# Altium schematic sheet Grabber_DIOT.schdoc: Grabber_DIOT
size 420 x 297 mm; Author: G.K.; CompanyName: WUT; DrawnBy: G.K.; Organization: WUT; Address1: Warsaw Univeristy of Technology; Address2: Nowowiejska 15/19; DocumentNumber: 1; SheetNumber: 2; SheetTotal: 5; EDA_Number: ARTIQ; Projet: ARTIQ/Sinara; ModifiedBy: -; CreateDate: -; CheckedDate: -; Title2: Extension board; DivGrp: ISE; Designer: G.K.; ModifiedDate: -; ProjectName: KASLI 3U subsystem
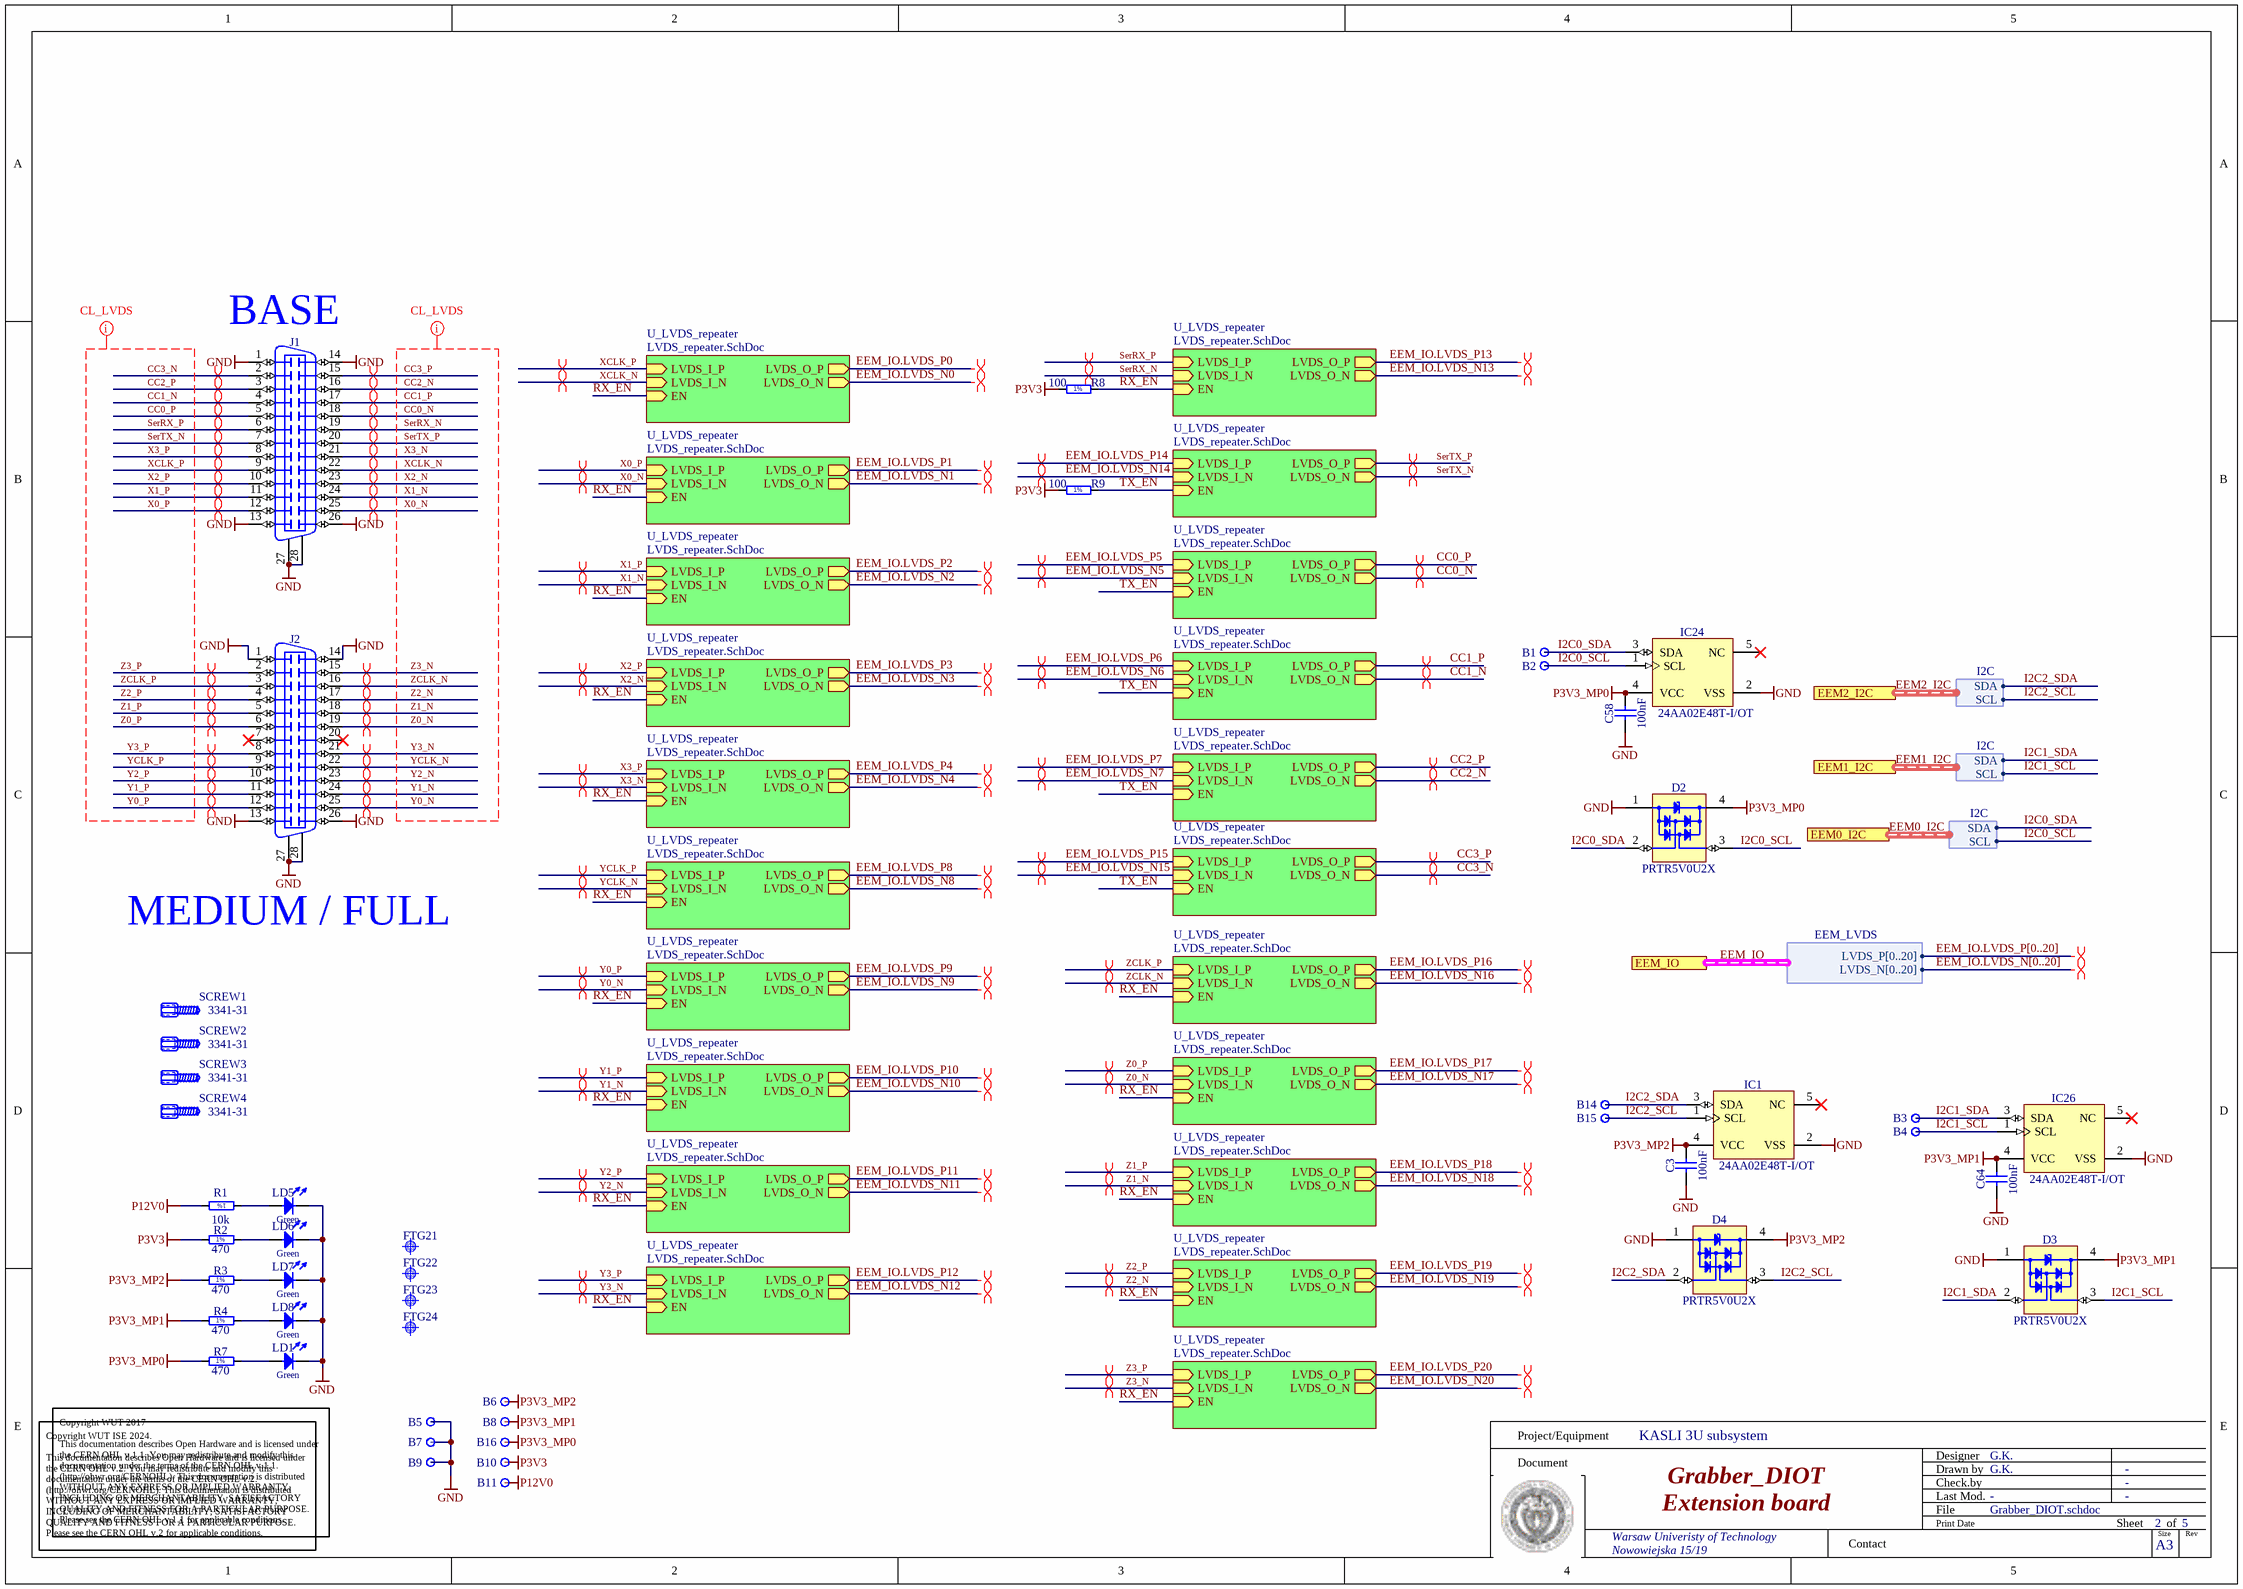
[diagram p0: Grabber_DIOT.schdoc]

## Parts
B1  Plated Hole  [c100h50]  (value not drawn)
B2  Plated Hole  [c100h50]  (value not drawn)
B3  Plated Hole  [c100h50]  (value not drawn)
B4  Plated Hole  [c100h50]  (value not drawn)
B5  Plated Hole  [c100h50]  (value not drawn)
B6  Plated Hole  [c100h50]  (value not drawn)
B7  Plated Hole  [c100h50]  (value not drawn)
B8  Plated Hole  [c100h50]  (value not drawn)
B9  Plated Hole  [c100h50]  (value not drawn)
B10  Plated Hole  [c100h50]  (value not drawn)
B11  Plated Hole  [c100h50]  (value not drawn)
B14  Plated Hole  [c100h50]  (value not drawn)
B15  Plated Hole  [c100h50]  (value not drawn)
B16  Plated Hole  [c100h50]  (value not drawn)
C3  100nF  [CAPC1005X55N]
C58  100nF  [CAPC1005X55N]
C64  100nF  [CAPC1005X55N]
D2  PRTR5V0U2X  [SOT190P230X110-4N]
D3  PRTR5V0U2X  [SOT190P230X110-4N]
D4  PRTR5V0U2X  [SOT190P230X110-4N]
FTG21  Use only in PCB  [FIDUCIAL_TOP_C100-200]  (value not drawn)
FTG22  Use only in PCB  [FIDUCIAL_TOP_S100-200]  (value not drawn)
FTG23  Use only in PCB  [FIDUCIAL_TOP_S200-400]  (value not drawn)
FTG24  Use only in PCB  [FIDUCIAL_TOP_S100-200]  (value not drawn)
IC1  24AA02E48T-I/OT  [SOT95P280X145-5N]
IC24  24AA02E48T-I/OT  [SOT95P280X145-5N]
IC26  24AA02E48T-I/OT  [SOT95P280X145-5N]
J1  N10226-5212PC  [3M_N10226-5212PC]  (value not drawn)
J2  N10226-5212PC  [3M_N10226-5212PC]  (value not drawn)
LD1  Green  [LED_KINGBRIGHT_KP-1608CGCK]  (value not drawn)
LD5  Green  [LED_KINGBRIGHT_KP-1608CGCK]  (value not drawn)
LD6  Green  [LED_KINGBRIGHT_KP-1608CGCK]  (value not drawn)
LD7  Green  [LED_KINGBRIGHT_KP-1608CGCK]  (value not drawn)
LD8  Green  [LED_KINGBRIGHT_KP-1608CGCK]  (value not drawn)
R1  10k  [RESC1005X40N]
R2  470  [RESC1005X40N]
R3  470  [RESC1005X40N]
R4  470  [RESC1005X40N]
R7  470  [RESC1005X40N]
R8  100  [RESC1005X40N]
R9  100  [RESC1005X40N]
SCREW1  3341-31  [3M_3341-31]
SCREW2  3341-31  [3M_3341-31]
SCREW3  3341-31  [3M_3341-31]
SCREW4  3341-31  [3M_3341-31]

## Sub-sheets
U_LVDS_repeater = LVDS_repeater.SchDoc: LVDS_I_P (in), LVDS_I_N (in), LVDS_O_P (out), LVDS_O_N (out), EN (in)
U_LVDS_repeater = LVDS_repeater.SchDoc: LVDS_I_P (in), LVDS_I_N (in), LVDS_O_P (out), LVDS_O_N (out), EN (in)
U_LVDS_repeater = LVDS_repeater.SchDoc: LVDS_I_P (in), LVDS_I_N (in), LVDS_O_P (out), LVDS_O_N (out), EN (in)
U_LVDS_repeater = LVDS_repeater.SchDoc: LVDS_I_P (in), LVDS_I_N (in), LVDS_O_P (out), LVDS_O_N (out), EN (in)
U_LVDS_repeater = LVDS_repeater.SchDoc: LVDS_I_P (in), LVDS_I_N (in), LVDS_O_P (out), LVDS_O_N (out), EN (in)
U_LVDS_repeater = LVDS_repeater.SchDoc: LVDS_I_P (in), LVDS_I_N (in), LVDS_O_P (out), LVDS_O_N (out), EN (in)
U_LVDS_repeater = LVDS_repeater.SchDoc: LVDS_I_P (in), LVDS_I_N (in), LVDS_O_P (out), LVDS_O_N (out), EN (in)
U_LVDS_repeater = LVDS_repeater.SchDoc: LVDS_I_P (in), LVDS_I_N (in), LVDS_O_P (out), LVDS_O_N (out), EN (in)
U_LVDS_repeater = LVDS_repeater.SchDoc: LVDS_I_P (in), LVDS_I_N (in), LVDS_O_P (out), LVDS_O_N (out), EN (in)
U_LVDS_repeater = LVDS_repeater.SchDoc: LVDS_I_P (in), LVDS_I_N (in), LVDS_O_P (out), LVDS_O_N (out), EN (in)
U_LVDS_repeater = LVDS_repeater.SchDoc: LVDS_I_P (in), LVDS_I_N (in), LVDS_O_P (out), LVDS_O_N (out), EN (in)
U_LVDS_repeater = LVDS_repeater.SchDoc: LVDS_I_P (in), LVDS_I_N (in), LVDS_O_P (out), LVDS_O_N (out), EN (in)
U_LVDS_repeater = LVDS_repeater.SchDoc: LVDS_I_P (in), LVDS_I_N (in), LVDS_O_P (out), LVDS_O_N (out), EN (in)
U_LVDS_repeater = LVDS_repeater.SchDoc: LVDS_I_P (in), LVDS_I_N (in), LVDS_O_P (out), LVDS_O_N (out), EN (in)
U_LVDS_repeater = LVDS_repeater.SchDoc: LVDS_I_P (in), LVDS_I_N (in), LVDS_O_P (out), LVDS_O_N (out), EN (in)
U_LVDS_repeater = LVDS_repeater.SchDoc: LVDS_I_P (in), LVDS_I_N (in), LVDS_O_P (out), LVDS_O_N (out), EN (in)
U_LVDS_repeater = LVDS_repeater.SchDoc: LVDS_I_P (in), LVDS_I_N (in), LVDS_O_P (out), LVDS_O_N (out), EN (in)
U_LVDS_repeater = LVDS_repeater.SchDoc: LVDS_I_P (in), LVDS_I_N (in), LVDS_O_P (out), LVDS_O_N (out), EN (in)
U_LVDS_repeater = LVDS_repeater.SchDoc: LVDS_I_P (in), LVDS_I_N (in), LVDS_O_P (out), LVDS_O_N (out), EN (in)
U_LVDS_repeater = LVDS_repeater.SchDoc: LVDS_I_P (in), LVDS_I_N (in), LVDS_O_P (out), LVDS_O_N (out), EN (in)
U_LVDS_repeater = LVDS_repeater.SchDoc: LVDS_I_P (in), LVDS_I_N (in), LVDS_O_P (out), LVDS_O_N (out), EN (in)

## Ports
EEM0_I2C (harness I2C), EEM1_I2C (harness I2C), EEM2_I2C (harness I2C), EEM_IO (harness EEM_LVDS)

## Harnesses
EEM_LVDS: LVDS_P[0..20], LVDS_N[0..20]
I2C: SDA, SCL

## Nets
GND: B5.1 B7.1 B9.1 C3.1 C58.1 C64.1 D2.1(GND) D3.1(GND) D4.1(GND) IC1.2(VSS) IC24.2(VSS) IC26.2(VSS) J1.1 J1.13 J1.14 J1.26 J1.27 J1.28 J2.1 J2.13 J2.14 J2.26 J2.27 J2.28 LD1.1(C) LD5.1(C) LD6.1(C) LD7.1(C) LD8.1(C)
P3V3: B10.1 R2.1 R8.1 R9.1
P3V3_MP0: B16.1 C58.2 D2.4(VCC) IC24.4(VCC) R7.1
P3V3_MP1: B8.1 C64.2 D3.4(VCC) IC26.4(VCC) R4.1
P3V3_MP2: B6.1 C3.2 D4.4(VCC) IC1.4(VCC) R3.1
P12V0: B11.1 R1.2
CC0_N: J1.18 ; sheet U_LVDS_repeater/LVDS_O_N
CC0_P: J1.5 ; sheet U_LVDS_repeater/LVDS_O_P
CC1_N: J1.4 ; sheet U_LVDS_repeater/LVDS_O_N
CC1_P: J1.17 ; sheet U_LVDS_repeater/LVDS_O_P
CC2_N: J1.16 ; sheet U_LVDS_repeater/LVDS_O_N
CC2_P: J1.3 ; sheet U_LVDS_repeater/LVDS_O_P
CC3_N: J1.2 ; sheet U_LVDS_repeater/LVDS_O_N
CC3_P: J1.15 ; sheet U_LVDS_repeater/LVDS_O_P
EEM_IO.LVDS_N0: sheet U_LVDS_repeater/LVDS_O_N
EEM_IO.LVDS_N1: sheet U_LVDS_repeater/LVDS_O_N
EEM_IO.LVDS_N2: sheet U_LVDS_repeater/LVDS_O_N
EEM_IO.LVDS_N3: sheet U_LVDS_repeater/LVDS_O_N
EEM_IO.LVDS_N4: sheet U_LVDS_repeater/LVDS_O_N
EEM_IO.LVDS_N5: sheet U_LVDS_repeater/LVDS_I_N
EEM_IO.LVDS_N6: sheet U_LVDS_repeater/LVDS_I_N
EEM_IO.LVDS_N7: sheet U_LVDS_repeater/LVDS_I_N
EEM_IO.LVDS_N8: sheet U_LVDS_repeater/LVDS_O_N
EEM_IO.LVDS_N9: sheet U_LVDS_repeater/LVDS_O_N
EEM_IO.LVDS_N10: sheet U_LVDS_repeater/LVDS_O_N
EEM_IO.LVDS_N11: sheet U_LVDS_repeater/LVDS_O_N
EEM_IO.LVDS_N12: sheet U_LVDS_repeater/LVDS_O_N
EEM_IO.LVDS_N13: sheet U_LVDS_repeater/LVDS_O_N
EEM_IO.LVDS_N14: sheet U_LVDS_repeater/LVDS_I_N
EEM_IO.LVDS_N15: sheet U_LVDS_repeater/LVDS_I_N
EEM_IO.LVDS_N16: sheet U_LVDS_repeater/LVDS_O_N
EEM_IO.LVDS_N17: sheet U_LVDS_repeater/LVDS_O_N
EEM_IO.LVDS_N18: sheet U_LVDS_repeater/LVDS_O_N
EEM_IO.LVDS_N19: sheet U_LVDS_repeater/LVDS_O_N
EEM_IO.LVDS_N20: sheet U_LVDS_repeater/LVDS_O_N
EEM_IO.LVDS_P0: sheet U_LVDS_repeater/LVDS_O_P
EEM_IO.LVDS_P1: sheet U_LVDS_repeater/LVDS_O_P
EEM_IO.LVDS_P2: sheet U_LVDS_repeater/LVDS_O_P
EEM_IO.LVDS_P3: sheet U_LVDS_repeater/LVDS_O_P
EEM_IO.LVDS_P4: sheet U_LVDS_repeater/LVDS_O_P
EEM_IO.LVDS_P5: sheet U_LVDS_repeater/LVDS_I_P
EEM_IO.LVDS_P6: sheet U_LVDS_repeater/LVDS_I_P
EEM_IO.LVDS_P7: sheet U_LVDS_repeater/LVDS_I_P
EEM_IO.LVDS_P8: sheet U_LVDS_repeater/LVDS_O_P
EEM_IO.LVDS_P9: sheet U_LVDS_repeater/LVDS_O_P
EEM_IO.LVDS_P10: sheet U_LVDS_repeater/LVDS_O_P
EEM_IO.LVDS_P11: sheet U_LVDS_repeater/LVDS_O_P
EEM_IO.LVDS_P12: sheet U_LVDS_repeater/LVDS_O_P
EEM_IO.LVDS_P13: sheet U_LVDS_repeater/LVDS_O_P
EEM_IO.LVDS_P14: sheet U_LVDS_repeater/LVDS_I_P
EEM_IO.LVDS_P15: sheet U_LVDS_repeater/LVDS_I_P
EEM_IO.LVDS_P16: sheet U_LVDS_repeater/LVDS_O_P
EEM_IO.LVDS_P17: sheet U_LVDS_repeater/LVDS_O_P
EEM_IO.LVDS_P18: sheet U_LVDS_repeater/LVDS_O_P
EEM_IO.LVDS_P19: sheet U_LVDS_repeater/LVDS_O_P
EEM_IO.LVDS_P20: sheet U_LVDS_repeater/LVDS_O_P
I2C0_SCL: B2.1 D2.3(I/O2) IC24.1(SCL) ; port EEM0_I2C.SCL  [project net EEM0_I2C.SCL]
I2C0_SDA: B1.1 D2.2(I/O1) IC24.3(SDA) ; port EEM0_I2C.SDA  [project net EEM0_I2C.SDA]
I2C1_SCL: B4.1 D3.3(I/O2) IC26.1(SCL) ; port EEM1_I2C.SCL  [project net EEM1_I2C.SCL]
I2C1_SDA: B3.1 D3.2(I/O1) IC26.3(SDA) ; port EEM1_I2C.SDA  [project net EEM1_I2C.SDA]
I2C2_SCL: B15.1 D4.3(I/O2) IC1.1(SCL) ; port EEM2_I2C.SCL  [project net EEM2_I2C.SCL]
I2C2_SDA: B14.1 D4.2(I/O1) IC1.3(SDA) ; port EEM2_I2C.SDA  [project net EEM2_I2C.SDA]
RX_EN: R8.2 ; sheet U_LVDS_repeater/EN, sheet U_LVDS_repeater/EN, sheet U_LVDS_repeater/EN, sheet U_LVDS_repeater/EN, sheet U_LVDS_repeater/EN, sheet U_LVDS_repeater/EN, sheet U_LVDS_repeater/EN, sheet U_LVDS_repeater/EN, sheet U_LVDS_repeater/EN, sheet U_LVDS_repeater/EN, sheet U_LVDS_repeater/EN, sheet U_LVDS_repeater/EN, sheet U_LVDS_repeater/EN, sheet U_LVDS_repeater/EN, sheet U_LVDS_repeater/EN, sheet U_LVDS_repeater/EN
SerRX_N: J1.19 ; sheet U_LVDS_repeater/LVDS_I_N
SerRX_P: J1.6 ; sheet U_LVDS_repeater/LVDS_I_P
SerTX_N: J1.7 ; sheet U_LVDS_repeater/LVDS_O_N
SerTX_P: J1.20 ; sheet U_LVDS_repeater/LVDS_O_P
TX_EN: R9.2 ; sheet U_LVDS_repeater/EN, sheet U_LVDS_repeater/EN, sheet U_LVDS_repeater/EN, sheet U_LVDS_repeater/EN, sheet U_LVDS_repeater/EN
X0_N: J1.25 ; sheet U_LVDS_repeater/LVDS_I_N
X0_P: J1.12 ; sheet U_LVDS_repeater/LVDS_I_P
X1_N: J1.24 ; sheet U_LVDS_repeater/LVDS_I_N
X1_P: J1.11 ; sheet U_LVDS_repeater/LVDS_I_P
X2_N: J1.23 ; sheet U_LVDS_repeater/LVDS_I_N
X2_P: J1.10 ; sheet U_LVDS_repeater/LVDS_I_P
X3_N: J1.21 ; sheet U_LVDS_repeater/LVDS_I_N
X3_P: J1.8 ; sheet U_LVDS_repeater/LVDS_I_P
XCLK_N: J1.22 ; sheet U_LVDS_repeater/LVDS_I_N
XCLK_P: J1.9 ; sheet U_LVDS_repeater/LVDS_I_P
Y0_N: J2.25 ; sheet U_LVDS_repeater/LVDS_I_N
Y0_P: J2.12 ; sheet U_LVDS_repeater/LVDS_I_P
Y1_N: J2.24 ; sheet U_LVDS_repeater/LVDS_I_N
Y1_P: J2.11 ; sheet U_LVDS_repeater/LVDS_I_P
Y2_N: J2.23 ; sheet U_LVDS_repeater/LVDS_I_N
Y2_P: J2.10 ; sheet U_LVDS_repeater/LVDS_I_P
Y3_N: J2.21 ; sheet U_LVDS_repeater/LVDS_I_N
Y3_P: J2.8 ; sheet U_LVDS_repeater/LVDS_I_P
YCLK_N: J2.22 ; sheet U_LVDS_repeater/LVDS_I_N
YCLK_P: J2.9 ; sheet U_LVDS_repeater/LVDS_I_P
Z0_N: J2.19 ; sheet U_LVDS_repeater/LVDS_I_N
Z0_P: J2.6 ; sheet U_LVDS_repeater/LVDS_I_P
Z1_N: J2.18 ; sheet U_LVDS_repeater/LVDS_I_N
Z1_P: J2.5 ; sheet U_LVDS_repeater/LVDS_I_P
Z2_N: J2.17 ; sheet U_LVDS_repeater/LVDS_I_N
Z2_P: J2.4 ; sheet U_LVDS_repeater/LVDS_I_P
Z3_N: J2.15 ; sheet U_LVDS_repeater/LVDS_I_N
Z3_P: J2.2 ; sheet U_LVDS_repeater/LVDS_I_P
ZCLK_N: J2.16 ; sheet U_LVDS_repeater/LVDS_I_N
ZCLK_P: J2.3 ; sheet U_LVDS_repeater/LVDS_I_P
NetLD1_2: LD1.2(A) R7.2
NetLD5_2: LD5.2(A) R1.1
NetLD6_2: LD6.2(A) R2.2
NetLD7_2: LD7.2(A) R3.2
NetLD8_2: LD8.2(A) R4.2

Not connected (* = marked no-connect by the designer): IC1 5(NC)*; IC24 5(NC)*; IC26 5(NC)*; J2 7* 20*

## Buses and harness runs
bus EEM_IO.LVDS_N[0..20]
bus EEM_IO.LVDS_P[0..20]
harness EEM0_I2C = port EEM0_I2C
harness EEM1_I2C = port EEM1_I2C
harness EEM2_I2C = port EEM2_I2C
harness EEM_IO = port EEM_IO

## Layout directives
differential pair: CC0_N, CC0_P, CC1_N, CC1_P, CC2_N, CC2_P, CC3_N, CC3_P, EEM_IO.LVDS_N0, EEM_IO.LVDS_N1, EEM_IO.LVDS_N2, EEM_IO.LVDS_N3, EEM_IO.LVDS_N4, EEM_IO.LVDS_N5, EEM_IO.LVDS_N6, EEM_IO.LVDS_N7, EEM_IO.LVDS_N8, EEM_IO.LVDS_N9, EEM_IO.LVDS_N10, EEM_IO.LVDS_N11, EEM_IO.LVDS_N12, EEM_IO.LVDS_N13, EEM_IO.LVDS_N14, EEM_IO.LVDS_N15, EEM_IO.LVDS_N16, EEM_IO.LVDS_N17, EEM_IO.LVDS_N18, EEM_IO.LVDS_N19, EEM_IO.LVDS_N20, EEM_IO.LVDS_P0, EEM_IO.LVDS_P1, EEM_IO.LVDS_P2, EEM_IO.LVDS_P3, EEM_IO.LVDS_P4, EEM_IO.LVDS_P5, EEM_IO.LVDS_P6, EEM_IO.LVDS_P7, EEM_IO.LVDS_P8, EEM_IO.LVDS_P9, EEM_IO.LVDS_P10, EEM_IO.LVDS_P11, EEM_IO.LVDS_P12, EEM_IO.LVDS_P13, EEM_IO.LVDS_P14, EEM_IO.LVDS_P15, EEM_IO.LVDS_P16, EEM_IO.LVDS_P17, EEM_IO.LVDS_P18, EEM_IO.LVDS_P19, EEM_IO.LVDS_P20, SerRX_N, SerRX_P, SerTX_N, SerTX_P, X0_N, X0_P, X1_N, X1_P, X2_N, X2_P, X3_N, X3_P, XCLK_N, XCLK_P, Y0_N, Y0_P, Y1_N, Y1_P, Y2_N, Y2_P, Y3_N, Y3_P, YCLK_N, YCLK_P, Z0_N, Z0_P, Z1_N, Z1_P, Z2_N, Z2_P, Z3_N, Z3_P, ZCLK_N, ZCLK_P
net class CL_LVDS: CC0_N, CC0_P, CC1_N, CC1_P, CC2_N, CC2_P, CC3_N, CC3_P, SerRX_N, SerRX_P, SerTX_N, SerTX_P, X0_N, X0_P, X1_N, X1_P, X2_N, X2_P, X3_N, X3_P, XCLK_N, XCLK_P, Y0_N, Y0_P, Y1_N, Y1_P, Y2_N, Y2_P, Y3_N, Y3_P, YCLK_N, YCLK_P, Z0_N, Z0_P, Z1_N, Z1_P, Z2_N, Z2_P, Z3_N, Z3_P, ZCLK_N, ZCLK_P
differential pair; differential pair class Diff_100Ohm: (no net found under the mark)

## Notes on the sheet
- (near J1) BASE
- MEDIUM / FULL
- Copyright WUT 2017
  This documentation describes Open Hardware and is licensed under the CERN OHL v.1.1. You may redistribute and modify this documentation under the terms of the CERN OHL v.1.1. (http://ohwr.org/CERNOHL). This documentation is distributed WITHOUT ANY EXPRESS OR IMPLIED WARRANTY, INCLUDING OF MERCHANTABILITY, SATISFACTORY QUALITY AND FITNESS FOR A PARTICULAR PURPOSE. Please see the CERN OHL v.1.1 for applicable conditions.
- Project/Equipment
- Document
- Designer
- Drawn by
- Check.by
- Copyright WUT ISE 2024.
  This documentation describes Open Hardware and is licensed under the CERN OHL v.2. You may redistribute and modify this documentation under the terms of the CERN OHL v.2. (http://ohwr.org/CERNOHL). This documentation is distributed WITHOUT ANY EXPRESS OR IMPLIED WARRANTY, INCLUDING OF MERCHANTABILITY, SATISFACTORY QUALITY AND FITNESS FOR A PARTICULAR PURPOSE. Please see the CERN OHL v.2 for applicable conditions.
- Contact
- File
- Last Mod.
- Print Date
- Sheet
- Size
- A3
- of
- Rev
- (in symbol R0402_10K_1%_0.0625W_100PPM) 1%
- (in symbol R0402_100R_1%_0.1W_100PPM) 1%
- (in symbol R0402_470R_1%_0.0625W_100PPM) 1%

## Library data of the parts
B1-B11 B14-B16 = PLATED_HOLE0.6_PAD1.3: Single Terminal Socket; Part Description: Plated Through Hole: Hole Dia.=0.6mm Pad Dia.=1.3mm; Mounted: No; Part Number: PLATED_HOLE0.6_PAD1.3; Component Kind: Standard (No BOM); Component Type: Standard (No BOM); Footprint: c130h60; Pin Count: 1; Family: Plated Hole; Socket: No; SMD: No; Sense: No; Status: None; ComponentHeight: 0mm; HelpURL: Undefined; Author: CERN DEM MR; CreateDate: 02.03.2016; LatestRevisionDate: 02.03.2016; PackageDescription: Plated Through Hole: Hole Dia.=0.6mm Pad Dia.=1.3mm
C3 C58 C64 = CC0402_100NF_16V_10%_X5R: Non-polarised capacitor; Part Description: SMD Multilayer Chip Ceramic Capacitor; Manufacturer: GENERIC; Manufacturer1 Part Number: GRM155R61C104KA88D; Voltage: 16V; TC: X5R; Tolerance: ±10%; Part Number: CC0402_100NF_16V_10%_X5R; Component Kind: Standard; Component Type: Standard; Pin Count: 2; Value: 100nF; Status: None; Manufacturer Part Number: CC0402_100NF_16V_10%_X5R; Case: 0402; Mounted: Yes; Socket: No; SMD: Yes; Sense: No; Manufacturer1 Example: MURATA; Manufacturer1 ComponentHeight: 0.55mm; HelpURL: \\cern.ch\dfs\Applications\Altium\Datasheets\CC0402_X5R_MURATA_GRM.pdf; Author: CERN DEM JLC; CreateDate: 10.12.2013; LatestRevisionDate: 10.12.2013
D2-D4 = PRTR5V0U2X: Ultra Low Capacitance Double Rail-to-Rail ESD Protection Diode; Part Description: Ultra Low Capacitance (1pF) Double Rail-to-Rail ESD Protection Diode (8kV); Manufacturer: NXP SEMICONDUCTORS; Voltage: 5.5V; PressFit: No; Bonding: No; Part Number: PRTR5V0U2X; Component Kind: Standard; Component Type: Standard; Device: PRTR5V0U2X; PackageDescription: SOT143B, SOT, 1.90mm Pitch; 4 Pin, 1.30mm W X 2.90mm L X 1.10mm H body, IPC Medium Density; Manufacturer Part Number: PRTR5V0U2X; Pin Count: 4; Case: SOT143B; Mounted: Yes; Socket: No; SMD: Yes; Sense: No; ComponentHeight: 1.1mm; HelpURL: \\cern.ch\dfs\Applications\Altium\Datasheets\PRTR5V0U2X.pdf; Author: CERN DEM JLC; CreateDate: 22.03.2011; LatestRevisionDate: 22.03.2011
FTG21 = FIDUCIAL_TARGET_C100-200: Fiducial Target; Part Description: Round Fiducial Target, Top Layer, 1.0mm, Top Solder 2.0mm, Keepout =2.0mm; Mounted: No; Part Number: FIDUCIAL_TARGET_C100-200; Component Kind: Standard (No BOM); Component Type: Standard (No BOM); Pin Count: 1; Family: Fiducial; Socket: No; SMD: Yes; Sense: No; Status: None; ComponentHeight: 0mm; HelpURL: Undefined; Author: CERN DEM JLC; CreateDate: 09.02.2010; LatestRevisionDate: 04.04.2012; PackageDescription: Round Fiducial Target, Top Layer, 1.0mm, Top Solder 2.0mm, Keepout =2.0mm
FTG22 FTG24 = FIDUCIAL_TARGET_S100-200: Fiducial Target; Part Description: Square Fiducial Target, Top Layer, 1.0mm, Top Solder 2.0mm, Keepout =2.0mm; Mounted: No; Part Number: FIDUCIAL_TARGET_S100-200; Component Kind: Standard (No BOM); Component Type: Standard (No BOM); Pin Count: 1; Family: Fiducial; Socket: No; SMD: Yes; Sense: No; Status: None; ComponentHeight: 0mm; HelpURL: Undefined; Author: CERN DEM JLC; CreateDate: 09.02.2010; LatestRevisionDate: 04.04.2012; PackageDescription: Square Fiducial Target, Top Layer, 1.0mm, Top Solder 2.0mm, Keepout =2.0mm
FTG23 = FIDUCIAL_TARGET_S200-400: Fiducial Target; Part Description: Square Fiducial Target, Top Layer, 2.0mm, Top Solder 4.0mm, Keepout =4.0mm; Mounted: No; Part Number: FIDUCIAL_TARGET_S200-400; Component Kind: Standard (No BOM); Component Type: Standard (No BOM); Pin Count: 1; Family: Fiducial; Socket: No; SMD: Yes; Sense: No; Status: None; ComponentHeight: 0mm; HelpURL: Undefined; Author: CERN DEM JLC; CreateDate: 02.06.2008; LatestRevisionDate: 04.04.2012; PackageDescription: Square Fiducial Target, Top Layer, 2.0mm, Top Solder 4.0mm, Keepout =4.0mm
IC1 IC24 IC26 = 24AA02E48T-I/OT: 1.7V-5.5V, 2K I2C Serial EEPROM With EUI-48 Node Identity; Manufacturer: MICROCHIP TECHNOLOGY; PressFit: No; Bonding: No; Part Number: 24AA02E48T-I/OT; Component Kind: Standard; Component Type: Standard; Device: 24AA02E48T-I/OT; PackageDescription: SOT, 0.95mm pitch; 5 pin, 1.60mm W X 2.90mm L X 1.45mm H body, IPC Medium Density; Part Description: 1.7V-5.5V, 2K I2C Serial EEPROM With EUI-48 Node Identity; Manufacturer Part Number: 24AA02E48T-I/OT; Pin Count: 5; Case: SOT23-5; Mounted: Yes; Socket: No; SMD: Yes; Sense: No; ComponentHeight: 1.45mm; HelpURL: \\cern.ch\dfs\Applications\Altium\Datasheets\24AA02E48T-I-OT.pdf; Author: CERN DEM MR; CreateDate: 31.03.2016; LatestRevisionDate: 31.03.2016
J1 J2 = 3M_N10226-5212PC: Connector Mini D Ribbon (MDR) 26 Female; Part Description: 26 contacts, Mini D Ribbon (MDR), .050" Boardmount Through-hole Right Angle Receptacle-Shielded, Diecast Body, 102 Series; Manufacturer: 3M; PressFit: No; Part Number: N10226-5212PC; Component Kind: Standard; Component Type: Standard; Footprint: MDR 26; Pin Count: 28; Family: MDR 26; Mounted: Yes; Socket: No; SMD: No; Sense: No; Status: None; Manufacturer Part Number: N10226-5212PC; ComponentHeight: 9.4mm; HelpURL: \\cern.ch\dfs\Applications\Altium\Datasheets\3M_N10226-5212PC.pdf; Author: CERN DEM JLC; CreateDate: 18.11.2008; LatestRevisionDate: 14.10.2009
LD1 LD5-LD8 = LED_KINGBRIGHT_KPH-1608CGCK: LED Green 1C 2A; Part Description: SMD Green LED, Case 1.6mmX0.8mm(0603), 0.65mm Thickness; PressFit: No; Bonding: No; Part Number: KPH-1608CGCK; Component Kind: Standard; Component Type: Standard; Color: Green; Footprint: LED_KINGBRIGHT_KPH-1608CGCK; PackageDescription: SMT Green LED, Case 0603, Body L 1.6 x W 0.8mm H 0.65mm; Manufacturer: KINGBRIGHT; Manufacturer Part Number: KPH-1608CGCK; Pin Count: 2; Mounted: Yes; Socket: No; SMD: Yes; Sense: No; ComponentHeight: 0.65mm; HelpURL: \\cern.ch\dfs\Applications\Altium\Datasheets\LED_KINGBRIGHT_KPH-1608CGCK.pdf; Author: CERN DEM JLC; CreateDate: 03.07.2017; LatestRevisionDate: 03.07.2017
R1 = R0402_10K_1%_0.0625W_100PPM: Resistor - 1%; Part Description: General Purpose Thick Film Chip Resistor; Manufacturer: GENERIC; Manufacturer1 Part Number: 232270671003L; TC: ±100ppm/°C; Part Number: R0402_10K_1%_0.0625W_100PPM; Component Kind: Standard; Component Type: Standard; Pin Count: 2; Value: 10k; Status: Not recommended; Power: 0.0625W; Tolerance: ±1%; Manufacturer Part Number: R0402_10K_1%_0.0625W_100PPM; Case: 0402; Mounted: Yes; Sense: No; Socket: No; SMD: Yes; Manufacturer1 Example: YAGEO PHYCOMP; Manufacturer1 ComponentHeight: 0.4mm; HelpURL: \\cern.ch\dfs\Applications\Altium\Datasheets\R0402_Phycomp_RC0402.pdf; Author: CERN DEM JLC; CreateDate: 03.12.2007; LatestRevisionDate: 17.10.2012
R2-R4 R7 = R0402_470R_1%_0.0625W_100PPM: Resistor - 1%; Part Description: General Purpose Thick Film Chip Resistor; Manufacturer: GENERIC; Manufacturer1 Part Number: 232270674701L; TC: ±100ppm/°C; PressFit: No; Part Number: R0402_470R_1%_0.0625W_100PPM; Component Kind: Standard; Component Type: Standard; Pin Count: 2; Value: 470; Status: Not Recommended; Power: 0.0625W; Tolerance: ±1%; Manufacturer Part Number: R0402_470R_1%_0.0625W_100PPM; Case: 0402; Mounted: Yes; Sense: No; Socket: No; SMD: Yes; Manufacturer1 Example: YAGEO PHYCOMP; Manufacturer1 ComponentHeight: 0.4mm; HelpURL: \\cern.ch\dfs\Applications\Altium\Datasheets\R0402_Phycomp_RC0402.pdf; Author: CERN DEM JLC; CreateDate: 03.12.2007; LatestRevisionDate: 17.10.2012
R8 R9 = R0402_100R_1%_0.1W_100PPM: Resistor - 1%; Part Description: General Purpose Thick Film Chip Resistor; Manufacturer: GENERIC; Manufacturer Part Number: R0402_100R_1%_0.1W_100PPM_50V; Manufacturer1 Part Number: ERJ2RKF1000X; Power: 0.1W; TC: ±100ppm/°C; Voltage: 50V; Part Number: R0402_100R_1%_0.1W_100PPM; Component Kind: Standard; Component Type: Standard; Pin Count: 2; Value: 100; Status: Not recommended; Tolerance: ±1%; Case: 0402; Mounted: Yes; Sense: No; Socket: No; SMD: Yes; Manufacturer1 Example: PANASONIC; Manufacturer1 ComponentHeight: 0.4mm; HelpURL: \\cern.ch\dfs\Applications\Altium\Datasheets\R0402_PANASONIC_ERJ2RK.pdf; Author: CERN DEM JLC; CreateDate: 12.12.2013; LatestRevisionDate: 03.03.2015
SCREW1-SCREW4 = MECH_MDR_screw_lock: VHDCI Female Screw Lock; Part Description: MDR Female Screw Locks, Thread Size: M2.5; Manufacturer: 3M; PressFit: No; Part Number: 3341-31; Component Kind: Standard; Component Type: Mechanical; Pin Count: 0; PackageDescription: MDR Female Screw Locks, Thread Size: M2.5; Mounted: Yes; Socket: No; SMD: No; Sense: No; Status: None; Value: 3341-31; Manufacturer Part Number: 3341-31; ComponentHeight: 5.48mm; HelpURL: \\cern.ch\dfs\Applications\Altium\Datasheets\TYCO_749087-2.pdf; Author: GK; CreateDate: 10.09.2013; LatestRevisionDate: 10.09.2013